# Altium schematic sheet Power_Supply.SchDoc: Power Supply
size Tabloid; DrawnBy: Dhrumil Parikh; SheetNumber: 3; SheetTotal: 3; PageSetup: Record=PageOptions|CenterHorizontal=True|CenterVertical=True|PrintScale=0.62|XCorrection=1.00|YCorrection=1.00|PrintKind=1|BorderSize=5000000|LeftOffset=0|BottomOffset=0|Orientation=2|PaperLength=1000|PaperWidth=1000|Scale=100|PaperSource=7|PrintQuality=600|MediaType=1|DitherType=10|PaperKind=Letter|PrintScaleMode=1; PageSize: T
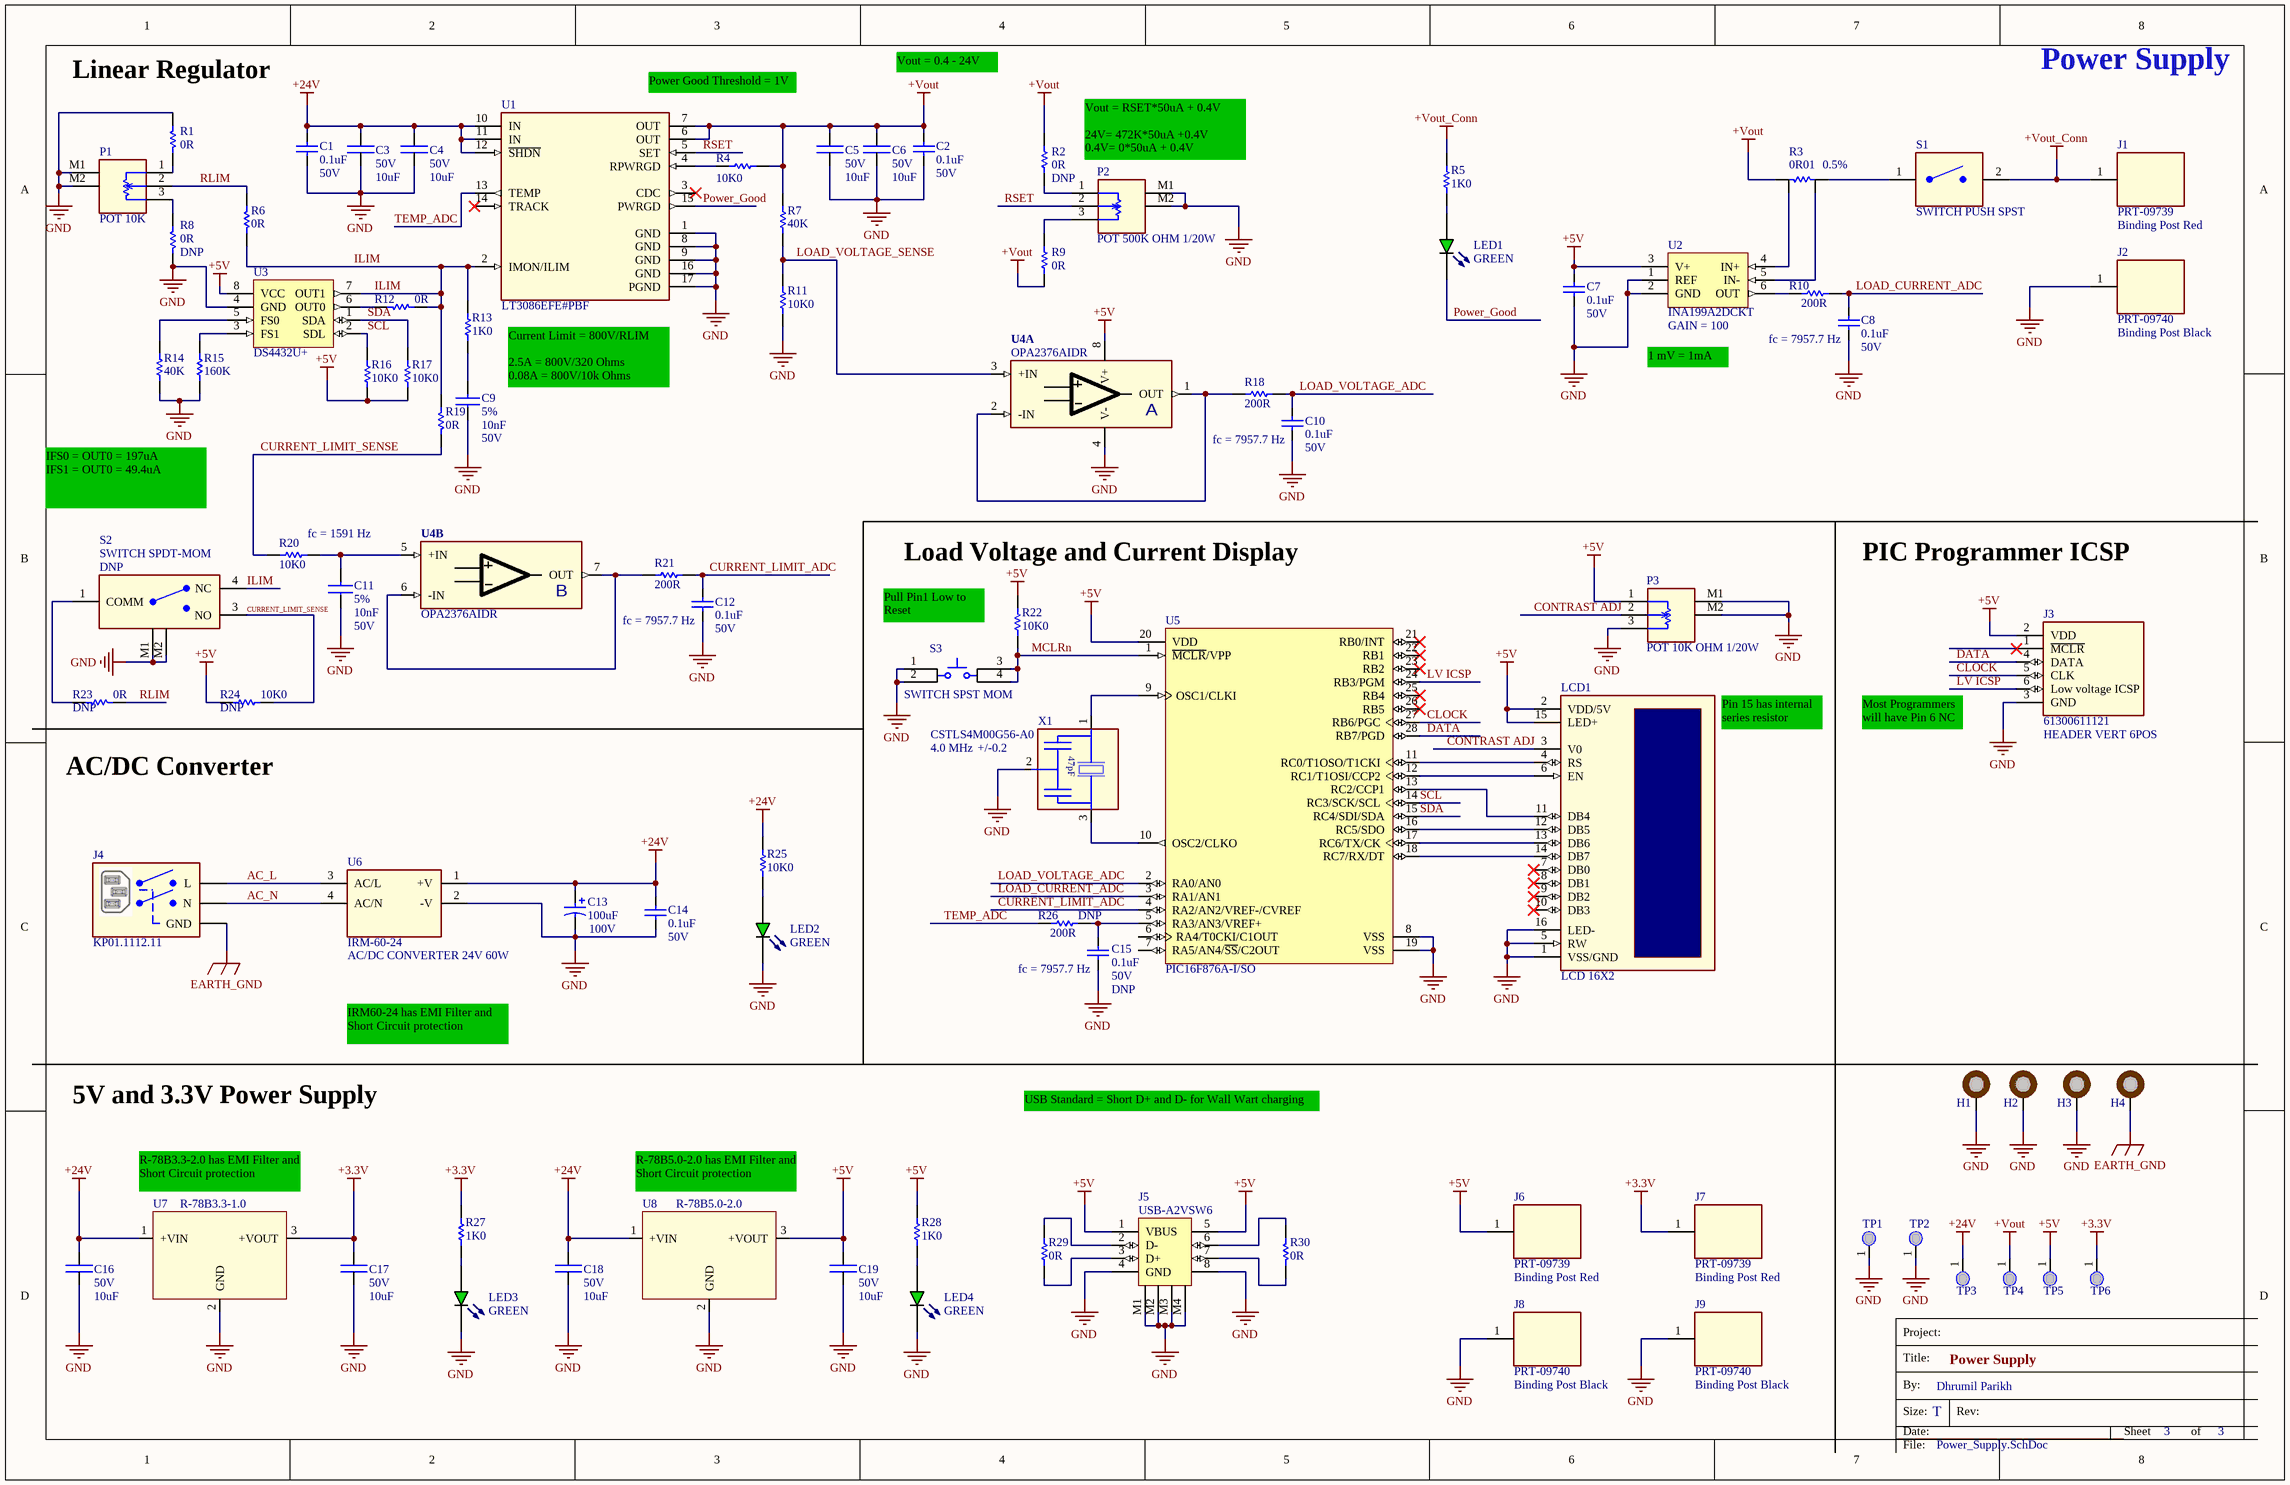
[diagram p0: Power_Supply.SchDoc]

## Parts
C1  value 0.1uF  VOLTAGE: 50V  [CAPC1005X06N]  (hidden comment: CAP CER 0.1UF 50V X7R 0402)
C2  value 0.1uF  VOLTAGE: 50V  [CAPC1005X06N]  (hidden comment: CAP CER 0.1UF 50V X7R 0402)
C3  value 10uF  VOLTAGE: 50V  [CAPC3225X28N]  (hidden comment: CAP CER 10UF 50V X7S 1210)
C4  value 10uF  VOLTAGE: 50V  [CAPC3225X28N]  (hidden comment: CAP CER 10UF 50V X7S 1210)
C5  value 10uF  VOLTAGE: 50V  [CAPC3225X28N]  (hidden comment: CAP CER 10UF 50V X7S 1210)
C6  value 10uF  VOLTAGE: 50V  [CAPC3225X28N]  (hidden comment: CAP CER 10UF 50V X7S 1210)
C7  value 0.1uF  VOLTAGE: 50V  [CAPC1005X06N]  (hidden comment: CAP CER 0.1UF 50V X7R 0402)
C8  value 0.1uF  VOLTAGE: 50V  [CAPC1005X06N]  (hidden comment: CAP CER 0.1UF 50V X7R 0402)
C9  value 10nF  TOLERANCE: 5%  VOLTAGE: 50V  [CAPC1608X09N]  (hidden comment: CAP CER 10000PF 50V 5% C0G 0603)
C10  value 0.1uF  VOLTAGE: 50V  [CAPC1005X06N]  (hidden comment: CAP CER 0.1UF 50V X7R 0402)
C11  value 10nF  TOLERANCE: 5%  VOLTAGE: 50V  [CAPC1608X09N]  (hidden comment: CAP CER 10000PF 50V 5% C0G 0603)
C12  value 0.1uF  VOLTAGE: 50V  [CAPC1005X06N]  (hidden comment: CAP CER 0.1UF 50V X7R 0402)
C13  value 100uF  VOLTAGE: 100V  [CAPAE1300X1400N]  (hidden comment: CAP ALUM 100UF 20% 100V SMD)
C14  value 0.1uF  VOLTAGE: 50V  [CAPC1005X06N]  (hidden comment: CAP CER 0.1UF 50V X7R 0402)
C15  value 0.1uF  NOSTUFF: DNP  VOLTAGE: 50V  [CAPC1005X06N]  (hidden comment: CAP CER 0.1UF 50V X7R 0402)
C16  value 10uF  VOLTAGE: 50V  [CAPC3225X28N]  (hidden comment: CAP CER 10UF 50V X7S 1210)
C17  value 10uF  VOLTAGE: 50V  [CAPC3225X28N]  (hidden comment: CAP CER 10UF 50V X7S 1210)
C18  value 10uF  VOLTAGE: 50V  [CAPC3225X28N]  (hidden comment: CAP CER 10UF 50V X7S 1210)
C19  value 10uF  VOLTAGE: 50V  [CAPC3225X28N]  (hidden comment: CAP CER 10UF 50V X7S 1210)
H1  MTG_HOLE PTH, 3.0mm  [MH_PTH_H3.0mmXP6.0mm]  (value not drawn)  (no BOM)
H2  MTG_HOLE PTH, 3.0mm  [MH_PTH_H3.0mmXP6.0mm]  (value not drawn)  (no BOM)
H3  MTG_HOLE PTH, 3.0mm  [MH_PTH_H3.0mmXP6.0mm]  (value not drawn)  (no BOM)
H4  MTG_HOLE PTH, 3.0mm  [MH_PTH_H3.0mmXP6.0mm]  (value not drawn)  (no BOM)
J1  value Binding Post Red  [PRT-09739]  (hidden comment: CONN BIND POST KNURLED RED)
J2  value Binding Post Black  [PRT-09740]  (hidden comment: CONN BIND POST KNURLED BLACK)
J3  value HEADER VERT 6POS  [61300611121]  (hidden comment: CONN HEADER VERT 6POS 2.54MM)
J4  PWR ENT MOD RCPT IEC320-C14 PNL  [KP01.1112.11]  (value not drawn)
J5  value USB-A2VSW6  [USB-A2VSW6]  (hidden comment: CONN RCPT TYPEA STACK 8POS VERT)
J6  value Binding Post Red  [PRT-09739]  (hidden comment: CONN BIND POST KNURLED RED)
J7  value Binding Post Red  [PRT-09739]  (hidden comment: CONN BIND POST KNURLED RED)
J8  value Binding Post Black  [PRT-09740]  (hidden comment: CONN BIND POST KNURLED BLACK)
J9  value Binding Post Black  [PRT-09740]  (hidden comment: CONN BIND POST KNURLED BLACK)
LCD1  value LCD 16X2  [LCD_16pin]  (hidden comment: STANDARD LCD 16X2 + EXTRAS)
LED1  value GREEN  [LED LTST-C190KGKT]  (hidden comment: LED GREEN)
LED2  value GREEN  [LED LTST-C190KGKT]  (hidden comment: LED GREEN)
LED3  value GREEN  [LED LTST-C190KGKT]  (hidden comment: LED GREEN)
LED4  value GREEN  [LED LTST-C190KGKT]  (hidden comment: LED GREEN)
P1  value POT 10K  [PTV09A]  (hidden comment: POT 10K OHM 1/20W CARBON LOG)
P2  value POT 500K OHM 1/20W  [PTV09A]  (hidden comment: POT 500K OHM 1/20W CARBON LOG)
P3  value POT 10K OHM 1/20W  [PTV09A]  (hidden comment: POT 10K OHM 1/20W CARBON LOG)
R1  value 0R  [RESC2012X07N]  (hidden comment: RES SMD 0 OHM JUMPER 1/8W 0805)
R2  value 0R  NOSTUFF: DNP  [RESC2012X07N]  (hidden comment: RES SMD 0 OHM JUMPER 1/8W 0805)
R3  value 0R01  TOLERANCE: 0.5%  [FC4TR010DER]  (hidden comment: RES 0.01 OHM 0.5% 1/2W 1206 WIDE)
R4  value 10K0  [RESC1608X06N]  (hidden comment: RES SMD 10K OHM 1% 1/4W 0603)
R5  value 1K0  [RESC1608X06N]  (hidden comment: RES SMD 1K OHM 1% 1/10W 0603)
R6  value 0R  [RESC2012X07N]  (hidden comment: RES SMD 0 OHM JUMPER 1/8W 0805)
R7  value 40K  [RESC1608X06N]  (hidden comment: RES SMD 40K OHM 0.1% 0.15W 0603)
R8  value 0R  NOSTUFF: DNP  [RESC2012X07N]  (hidden comment: RES SMD 0 OHM JUMPER 1/8W 0805)
R9  value 0R  [RESC2012X07N]  (hidden comment: RES SMD 0 OHM JUMPER 1/8W 0805)
R10  value 200R  [RESC1608X06N]  (hidden comment: RES SMD 200 OHM 1% 1/10W 0603)
R11  value 10K0  [RESC1608X06N]  (hidden comment: RES SMD 10K OHM 1% 1/4W 0603)
R12  value 0R  [RESC2012X07N]  (hidden comment: RES SMD 0 OHM JUMPER 1/8W 0805)
R13  value 1K0  [RESC1608X06N]  (hidden comment: RES SMD 1K OHM 1% 1/10W 0603)
R14  value 40K  [RESC1608X06N]  (hidden comment: RES SMD 40K OHM 0.1% 0.15W 0603)
R15  value 160K  [RESC1608X06N]  (hidden comment: RES SMD 160K OHM 1% 1/10W 0603)
R16  value 10K0  [RESC1608X06N]  (hidden comment: RES SMD 10K OHM 1% 1/4W 0603)
R17  value 10K0  [RESC1608X06N]  (hidden comment: RES SMD 10K OHM 1% 1/4W 0603)
R18  value 200R  [RESC1608X06N]  (hidden comment: RES SMD 200 OHM 1% 1/10W 0603)
R19  value 0R  [RESC2012X07N]  (hidden comment: RES SMD 0 OHM JUMPER 1/8W 0805)
R20  value 10K0  [RESC1608X06N]  (hidden comment: RES SMD 10K OHM 1% 1/4W 0603)
R21  value 200R  [RESC1608X06N]  (hidden comment: RES SMD 200 OHM 1% 1/10W 0603)
R22  value 10K0  [RESC1608X06N]  (hidden comment: RES SMD 10K OHM 1% 1/4W 0603)
R23  value 0R  NOSTUFF: DNP  [RESC2012X07N]  (hidden comment: RES SMD 0 OHM JUMPER 1/8W 0805)
R24  value 10K0  NOSTUFF: DNP  [RESC1608X06N]  (hidden comment: RES SMD 10K OHM 1% 1/4W 0603)
R25  value 10K0  [RESC1608X06N]  (hidden comment: RES SMD 10K OHM 1% 1/4W 0603)
R26  value 200R  NOSTUFF: DNP  [RESC1608X06N]  (hidden comment: RES SMD 200 OHM 1% 1/10W 0603)
R27  value 1K0  [RESC1608X06N]  (hidden comment: RES SMD 1K OHM 1% 1/10W 0603)
R28  value 1K0  [RESC1608X06N]  (hidden comment: RES SMD 1K OHM 1% 1/10W 0603)
R29  value 0R  [RESC2012X07N]  (hidden comment: RES SMD 0 OHM JUMPER 1/8W 0805)
R30  value 0R  [RESC2012X07N]  (hidden comment: RES SMD 0 OHM JUMPER 1/8W 0805)
S1  value SWITCH PUSH SPST  [PB1973ABLKBLKEF0]  (hidden comment: SWITCH PUSH SPST 15A 250V)
S2  value SWITCH SPDT-MOM  NOSTUFF: DNP  [KS12R22CQD]  (hidden comment: SWITCH PUSH SPDT 0.025A 50V)
S3  value SWITCH SPST MOM  [PTS645SM43SMTR92LFS]  (hidden comment: SWITCH TACTILE SPST-NO 0.05A 12V)
TP1  Testpoint Harwin S2751-46R  [TP_HARWIN_2751-46R]  (value not drawn)
TP2  Testpoint Harwin S2751-46R  [TP_HARWIN_2751-46R]  (value not drawn)
TP3  Testpoint Harwin S2751-46R  [TP_HARWIN_2751-46R]  (value not drawn)
TP4  Testpoint Harwin S2751-46R  [TP_HARWIN_2751-46R]  (value not drawn)
TP5  Testpoint Harwin S2751-46R  [TP_HARWIN_2751-46R]  (value not drawn)
TP6  Testpoint Harwin S2751-46R  [TP_HARWIN_2751-46R]  (value not drawn)
U1  value LT3086EFE#PBF  [TSOP65P640X110_HS-17N]  (hidden comment: IC REG LIN POS ADJ 2.1A 16TSSOP)
U2  value INA199A2DCKT  GAIN: GAIN = 100  [TSOP65P240X110-6N]  (hidden comment: IC OPAMP CURR SENSE 14KHZ SC70-6)
U3  value DS4432U+  [TSOP65P490X110-8N]  (hidden comment: IC DAC 7BIT A-OUT 8UMAX)
U4  value OPA2376AIDR  [SOIC127P600X175-8N_OPA2376AIDR]  (hidden comment: IC OPA2376AIDR)  (parts A,B of 2)
U5  PIC16F876A-I/SO  [SOIC127P1030X264-28N]
U6  MFG_PART_NO: IRM-60-24  [IRM6024]  (hidden comment: AC/DC CONVERTER 24V 60W)
U7  MFG_PART_NO: R-78B3.3-1.0  [DC_Module_TH_R-78Bxx-1.0]  (hidden comment: DC DC CONVERTER 3.3V 3W)
U8  MFG_PART_NO: R-78B5.0-2.0  [DC_Module_TH_R-78Bxx-1.0]  (hidden comment: DC DC CONVERTER 5V 10W)
X1  value 4.0 MHz  STABILITY: +/-0.2  [CSTLS4M00G56-A0]  (hidden comment: CER RESONATOR)

## Nets
+3.3V: C17.1 J7.1 R27.2 TP6.1 U7.3(+VOUT)
+5V: C7.1 C19.1 J3.2(VDD) J5.1(VBUS) J5.5(VBUS) J6.1 LCD1.2(VDD/5V) LCD1.15(LED+) P3.1 R16.1 R17.1 R22.2 R24.2 R28.2 TP5.1 U2.3(V+) U3.8(VCC) U4.8(V+) U5.20(VDD) U8.3(+VOUT)
+24V: C1.1 C3.1 C4.1 C13.1 C14.1 C16.1 C18.1 R25.2 TP3.1 U1.10(IN) U1.11(IN) U1.12(~{SHDN}) U6.1(+V) U7.1(+VIN) U8.1(+VIN)
+Vout: C2.1 C5.1 C6.1 R2.2 R3.1 R4.1 R7.2 R9.1 TP4.1 U1.6(OUT) U1.7(OUT)
+Vout_Conn: J1.1 R5.2 S1.2
EARTH_GND: H4.1 J4.GND
GND: C1.2 C2.2 C3.2 C4.2 C5.2 C6.2 C7.2 C8.2 C9.1 C10.2 C11.1 C12.2 C13.2 C14.2 C15.2 C16.2 C17.2 C18.2 C19.2 H1.1 H2.1 H3.1 J2.1 J3.3(GND) J5.4(GND) J5.8(GND) J5.M1 J5.M2 J5.M3 J5.M4 J8.1 J9.1 LCD1.1(VSS/GND) LCD1.5(RW) LCD1.16(LED-) LED2.K LED3.K LED4.K P1.M1 P1.M2 P2.M1 P2.M2 P3.3 P3.M1 P3.M2 R1.2 R8.1 R11.1 R14.1 R15.1 S2.M1 S2.M2 S3.1 S3.2 TP1.1 TP2.1 U1.1(GND) U1.8(GND) U1.9(GND) U1.16(GND) U1.17(PGND) U2.1(REF) U2.2(GND) U3.4(GND) U4.4(V-) U5.8(VSS) U5.19(VSS) U6.2(-V) U7.2(GND) U8.2(GND) X1.2
AC_L: J4.L U6.3(AC/L)
AC_N: J4.N U6.4(AC/N)
CLOCK: J3.5(CLK) U5.27(RB6/PGC)
CONTRAST ADJ: LCD1.3(V0) P3.2
CURRENT_LIMIT_ADC: C12.1 R21.2 U5.4(RA2/AN2/VREF-/CVREF)
CURRENT_LIMIT_SENSE: R19.1 R20.2 R24.1 S2.3(NO)
DATA: J3.4(DATA) U5.28(RB7/PGD)
ILIM: R6.2 R12.1 R13.2 R19.2 S2.4(NC) U1.2(IMON/ILIM) U3.7(OUT1)
LOAD_CURRENT_ADC: C8.1 R10.2 U5.3(RA1/AN1)
LOAD_VOLTAGE_ADC: C10.1 R18.2 U5.2(RA0/AN0)
LOAD_VOLTAGE_SENSE: R7.1 R11.2 U4.3(+IN)
LV ICSP: J3.6(Low_voltage_ICSP) U5.24(RB3/PGM)
MCLRn: R22.1 S3.3 S3.4 U5.1(~{MCLR}/VPP)
Power_Good: LED1.K U1.15(PWRGD)
RLIM: P1.2 R6.1 R23.1
RSET: P2.2 U1.5(SET)
SCL: R16.2 U3.2(SDL) U5.14(RC3/SCK/SCL)
SDA: R17.2 U3.1(SDA) U5.15(RC4/SDI/SDA)
TEMP_ADC: R26.1 U1.13(TEMP)
NetC9_2: C9.2 R13.1
NetC11_2: C11.2 R20.1 U4.5(+IN)
NetC15_1: C15.1 R26.2 U5.5(RA3/AN3/VREF+)
NetJ5_2: J5.2(D-) R29.2
NetJ5_3: J5.3(D+) R29.1
NetJ5_6: J5.6(D-) R30.2
NetJ5_7: J5.7(D+) R30.1
NetLCD1_4: LCD1.4(RS) U5.11(RC0/T1OSO/T1CKI)
NetLCD1_6: LCD1.6(EN) U5.12(RC1/T1OSI/CCP2)
NetLCD1_11: LCD1.11(DB4) U5.13(RC2/CCP1)
NetLCD1_12: LCD1.12(DB5) U5.16(RC5/SDO)
NetLCD1_13: LCD1.13(DB6) U5.17(RC6/TX/CK)
NetLCD1_14: LCD1.14(DB7) U5.18(RC7/RX/DT)
NetLED1_A: LED1.A R5.1
NetLED2_A: LED2.A R25.1
NetLED3_A: LED3.A R27.1
NetLED4_A: LED4.A R28.1
NetP1_1: P1.1 R1.1
NetP1_3: P1.3 R8.2
NetP2_1: P2.1 R2.1
NetP2_3: P2.3 R9.2
NetR3_2: R3.2 S1.1
NetR3_3: R3.3 U2.4(IN+)
NetR3_4: R3.4 U2.5(IN-)
NetR4_2: R4.2 U1.4(RPWRGD)
NetR10_1: R10.1 U2.6(OUT)
NetR12_2: R12.2 U3.6(OUT0)
NetR14_2: R14.2 U3.5(FS0)
NetR15_2: R15.2 U3.3(FS1)
NetR18_1: R18.1 U4.1(OUT) U4.2(-IN)
NetR21_1: R21.1 U4.6(-IN) U4.7(OUT)
NetR23_2: R23.2 S2.1(COMM)
NetU5_9: U5.9(OSC1/CLKI) X1.1
NetU5_10: U5.10(OSC2/CLKO) X1.3

Not connected (* = marked no-connect by the designer): J3 1(~{MCLR})*; LCD1 7(DB0)* 8(DB1)* 9(DB2)* 10(DB3)*; U1 3(CDC)* 14(TRACK)*; U5 6(RA4/T0CKI/C1OUT) 7(RA5/AN4/~{SS}/C2OUT) 21(RB0/INT)* 22(RB1)* 23(RB2)* 25(RB4)* 26(RB5)*

## Notes on the sheet
- Linear Regulator
- (near U1) Power Good Threshold = 1V
- Vout = 0.4 - 24V
- Vout = RSET*50uA + 0.4V
  24V= 472K*50uA +0.4V
  0.4V= 0*50uA + 0.4V
- 1 mV = 1mA
- (near C8) fc = 7957.7 Hz
- Current Limit = 800V/RLIM
  2.5A = 800V/320 Ohms
  0.08A = 800V/10k Ohms
- (near C10) fc = 7957.7 Hz
- IFS0 = OUT0 = 197uA
  IFS1 = OUT0 = 49.4uA
- (near R20) fc = 1591 Hz
- (near R22) Load Voltage and Current Display
- PIC Programmer ICSP
- (near C12) fc = 7957.7 Hz
- Pull Pin1 Low to Reset
- Pin 15 has internal series resistor
- Most Programmers will have Pin 6 NC
- AC/DC Converter
- (near C15) fc = 7957.7 Hz
- 5V and 3.3V Power Supply
- IRM60-24 has EMI Filter and Short Circuit protection
- USB Standard = Short D+ and D- for Wall Wart charging
- (near U7) R-78B3.3-2.0 has EMI Filter and Short Circuit protection
- (near U8) R-78B5.0-2.0 has EMI Filter and Short Circuit protection
- Title:
- Project:
- Size:
- Date:
- By:
- Rev:
- Sheet
- of
- File:
- (in symbol CER RESONATOR) 47pF
- (in symbol IC OPA2376AIDR, part A) A
- (in symbol IC OPA2376AIDR, part B) B

## Library data of the parts
C1 C2 C7 C8 C10 C12 C14 C15 = CAP CER 0.1UF 50V X7R 0402: MFG_PART_NO: UMK105B7104KVHF; MFG: Taiyo Yuden; TOLERANCE: 10%; COST: 0.3; DIELECTRIC: X7R
C3-C6 C16-C19 = CAP CER 10UF 50V X7S 1210: MFG_PART_NO: UMK325C7106MM-T; MFG: Taiyo Yuden; TOLERANCE: 20%; COST: 1.14; DIELECTRIC: X7S
C9 C11 = CAP CER 10000PF 50V 5% C0G 0603: MFG_PART_NO: GRM1885C1H103JA01D; MFG: Murata; DIELECTRIC: C0G/NP0; COST: 0.3
C13 = CAP ALUM 100UF 20% 100V SMD: MFG_PART_NO: EMVY101ARA101MKE0S; MFG: United Chemi-Con; TOLERANCE: 20%; COST: 2.51
H1-H4 = MTG_HOLE PTH, 3.0mm: PTH, 3.0mm; VALUE: PTH_3.0MM
J1 J6 J7 = CONN BIND POST KNURLED RED: MFG: SparkFun Electronics; COST: 0.49; MFG_PART_NO: PRT-09739
J2 J8 J9 = CONN BIND POST KNURLED BLACK: MFG: SparkFun Electronics; COST: 0.49; MFG_PART_NO: PRT-09740
J3 = CONN HEADER VERT 6POS 2.54MM: MFG: Wurth Electronics Inc.; COST: 0.47; MFG_PART_NO: 61300611121
J4 = PWR ENT MOD RCPT IEC320-C14 PNL: MFG: Schurter Inc.; VALUE: Power Entry Connector; COST: 21.59; MFG_PART_NO: KP01.1112.11
J5 = CONN RCPT TYPEA STACK 8POS VERT: MFG: On Shore Technology Inc.; MFG_PART_NO: USB-A2VSW6; COST: 1.29
LCD1 = STANDARD LCD 16X2 + EXTRAS: MFG_PART_NO: 181; MFG: Adafruit Industries LLC; COST: 14.07
LED1-LED4 = LED GREEN: LED SUPER GREEN CLEAR 0603 SMD; MFG_PART_NO: 0.39; MFG: Lite-On; COST: 0.05
P1 P3 = POT 10K OHM 1/20W CARBON LOG: MFG_PART_NO: PTV09A-4020F-A103; MFG: Bourns Inc.; COST: 1.17
P2 = POT 500K OHM 1/20W CARBON LOG: MFG_PART_NO: PTV09A-4020F-A504; MFG: Bourns Inc.; COST: 1.17
R1 R2 R6 R8 R9 R12 R19 R23 R29 R30 = RES SMD 0 OHM JUMPER 1/8W 0805: MFG_PART_NO: ERJ-6GEY0R00V; MFG: Panasonic; COST: 0.15
R3 = RES 0.01 OHM 0.5% 1/2W 1206 WIDE: MFG: Ohmite; COST: 1.19; MFG_PART_NO: FC4TR010DER
R4 R11 R16 R17 R20 R22 R24 R25 = RES SMD 10K OHM 1% 1/4W 0603: MFG_PART_NO: ESR03EZPF1002; MFG: Rohm; COST: 0.2; TOLERANCE: 1%
R5 R13 R27 R28 = RES SMD 1K OHM 1% 1/10W 0603: MFG_PART_NO: RMCF0603FT1K00; MFG: Stackpole; COST: 0.15; TOLERANCE: 1%
R7 R14 = RES SMD 40K OHM 0.1% 0.15W 0603: MFG_PART_NO: PAT0603E4002BST1; MFG: Vishay Thin Film; COST: 1.46; TOLERANCE: 0.1%
R10 R18 R21 R26 = RES SMD 200 OHM 1% 1/10W 0603: MFG_PART_NO: RC0603FR-07200RL; MFG: Yageo; POWER: 0.1W; COST: 0.15
R15 = RES SMD 160K OHM 1% 1/10W 0603: MFG_PART_NO: RC0603FR-07160KL; MFG: Yageo; COST: 0.15; TOLERANCE: 1%
S1 = SWITCH PUSH SPST 15A 250V: MFG: E-Switch; COST: 2.59; MFG_PART_NO: PB1973ABLKBLKEF0
S2 = SWITCH PUSH SPDT 0.025A 50V: MFG: C&K; COST: 3.58; MFG_PART_NO: KS12R22CQD
S3 = SWITCH TACTILE SPST-NO 0.05A 12V: MFG_PART_NO: PTS645SM43SMTR92 LFS; MFG: C&K; COST: 0.24; VOLTAGE: 12V; CURRENT: 0.05A
TP1-TP6 = Testpoint Harwin S2751-46R: PC TEST POINT TIN SMD; MFG: Harwin Inc.; MFG_PART_NO: S2751-46R; COST: 0.12320
U1 = IC REG LIN POS ADJ 2.1A 16TSSOP: MFG: Linear Technology/Analog Devices; COST: 24.76; MFG_PART_NO: LT3086EFE#PBF
U2 = IC OPAMP CURR SENSE 14KHZ SC70-6: MFG: TE Connectivity AMP Connectors; MFG_PART_NO: INA199A2DCKT; COST: 1.29
U3 = IC DAC 7BIT A-OUT 8UMAX: MFG: Maxim Integrated; MFG_PART_NO: DS4432U+; COST: 1.82
U4 = IC OPA2376AIDR: IC OPAMP GP 5.5MHZ RRO 8SOIC; MFG: TI; MFG_PART_NO: OPA2376AIDR; COST: 3.82
U5 = IC MCU 8BIT 14KB FLASH 28SOIC: MFG: Microchip Technology; COST: 4.67; MFG_PART_NO: PIC16F876A-I/SO; PACKAGE: 28-SOIC
U6 = AC/DC CONVERTER 24V 60W: MFG: MEAN WELL USA Inc.; COST: 24.76; VALUE: AC/DC CONVERTER 24V 60W
U7 = DC DC CONVERTER 3.3V 3W: MFG: Recom Power; VALUE: DC DC CONVERTER 3.3V 3W; COST: 12.72
U8 = DC DC CONVERTER 5V 10W: MFG: Recom Power; VALUE: DC DC CONVERTER 5V 10W; COST: 12.72
X1 = CER RESONATOR: TOLERANCE: +/-0.5; COST: 0.34; MFG: CER RESONATOR; MFG_PART_NO: CSTLS4M00G56-A0